# Altium schematic sheet LEDRGB.SchDoc
size A3; SheetNumber: 9; SheetTotal: 22
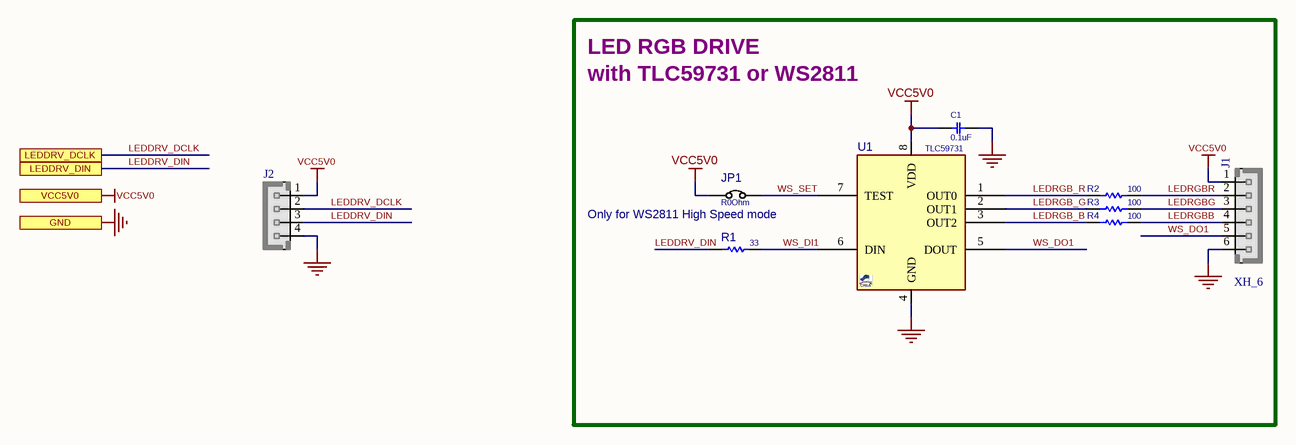
[diagram p0: LEDRGB.SchDoc]

## Parts
C1  0.1uF  [C0402]
J1  XH_6  [XH_6]
J2  HHDR_4  [XH_4]  (value not drawn)
JP1  R0Ohm  [JP_60X100]
R1  33  [R0402]
R2  100  [R0402]
R3  100  [R0402]
R4  100  [R0402]
U1  TLC59731  [SO_8A]

## Ports
GND, LEDDRV_DCLK, LEDDRV_DIN, VCC5V0

## Nets
GND: C1.1 J1.6 J2.4 U1.4(GND) ; port GND
VCC5V0: C1.2 J1.1 J2.1 JP1.1 U1.8(VDD) ; port VCC5V0
LEDDRV_DCLK: J2.2 ; port LEDDRV_DCLK
LEDDRV_DIN: J2.3 R1.1 ; port LEDDRV_DIN
LEDRGB_B: R4.1 U1.3(OUT2)
LEDRGB_G: R3.1 U1.2(OUT1)
LEDRGB_R: R2.1 U1.1(OUT0)
LEDRGBB: J1.4 R4.2
LEDRGBG: J1.3 R3.2
LEDRGBR: J1.2 R2.2
WS_DI1: R1.2 U1.6(DIN)
WS_DO1: J1.5 U1.5(DOUT)
WS_SET: JP1.2 U1.7(TEST)

## Notes on the sheet
- with TLC59731 or WS2811
- LED RGB DRIVE
- (near JP1) Only for WS2811 High Speed mode

## Library data of the parts
C1 = CAP_SMD_MLCC_1: CAP, MLCC; PARAM: X5R, 10%; MANF_P#: GRM155R61E104; MANF: Murata; PARAM2: 25v; PRICE: 10,000:$0.006; DESC: -; ASSEMBLY: ASSEMBLY; VALUE: 0.1uF
J1 = XH_6: JST-XH pitch: 2.5mm; MANF_P#: JST-S6B-XHA; MANF: JST; VALUE: XH_6
J2 = XH_4: JST-XH pitch: 2.5mm; VALUE: HHDR_4; MANF: -; MANF_P#: -
JP1 = JUMPER_HDR_2P: JUMPER, HEADER 2PIN; MANF: -; MANF_P#: -; VALUE: R0Ohm
R1-R4 = RES_SMD_1: RESISTOR, SMD; PARAM: 0.063W; DESC: DESCRIPTION; DIST#: MOUSER; PARAM2: 1%; MANF_P#: -; MANF: -; ASSEMBLY: ASSEMBLY; PRICE: 100= 0.5$
  R1: VALUE: 33
  R2-R4: VALUE: 100
U1 = TLC59731_SOP8: Signal line 256 Gray level 3-ch Constant current LED drive; MANF: Texas Instruments; MANF_P#: TLC59731D; PARAM2: 3.3/5VDD; PARAM: 50mA, 600Kpps, -40~+125℃; PRICE: 0.8$; VALUE: TLC59731